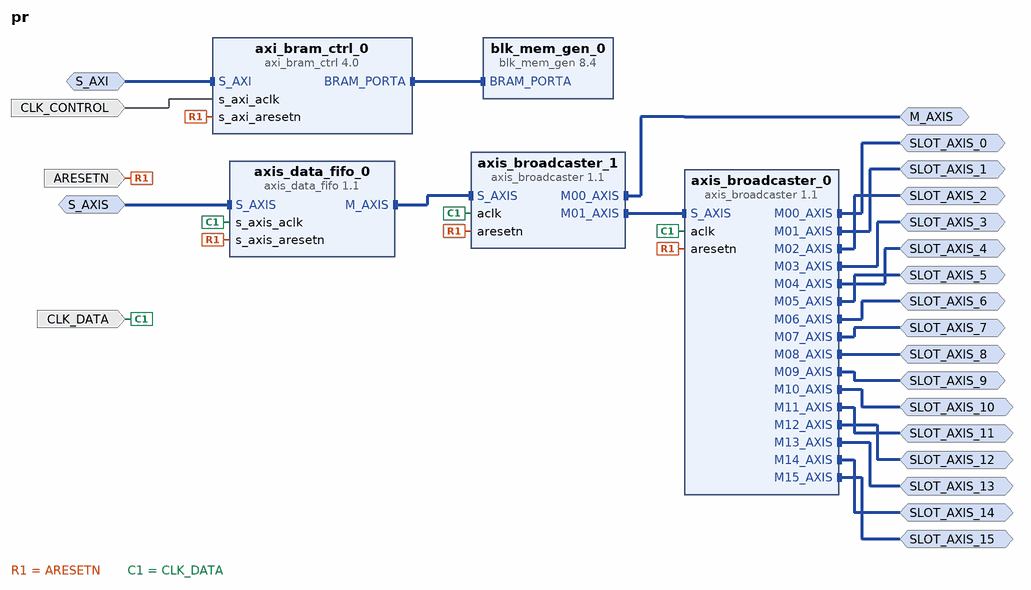
[diagram p0: block diagram of the top level]
# Vivado block design pr, xcku115-flva1517-2-e, Vivado 2017.2
create_bd_design pr

create_bd_intf_port -mode Slave -vlnv xilinx.com:interface:aximm_rtl:1.0 S_AXI
set_property -dict [list \
  CONFIG.DATA_WIDTH 64 \
  CONFIG.PROTOCOL AXI4 \
  CONFIG.ID_WIDTH 0 \
  CONFIG.ADDR_WIDTH 16 \
  CONFIG.AWUSER_WIDTH 0 \
  CONFIG.ARUSER_WIDTH 0 \
  CONFIG.WUSER_WIDTH 0 \
  CONFIG.RUSER_WIDTH 0 \
  CONFIG.BUSER_WIDTH 0 \
  CONFIG.READ_WRITE_MODE READ_WRITE \
  CONFIG.HAS_BURST 1 \
  CONFIG.HAS_LOCK 1 \
  CONFIG.HAS_PROT 1 \
  CONFIG.HAS_CACHE 1 \
  CONFIG.HAS_QOS 0 \
  CONFIG.HAS_REGION 0 \
  CONFIG.HAS_WSTRB 1 \
  CONFIG.HAS_BRESP 1 \
  CONFIG.HAS_RRESP 1 \
  CONFIG.SUPPORTS_NARROW_BURST 1 \
  CONFIG.NUM_READ_OUTSTANDING 2 \
  CONFIG.NUM_WRITE_OUTSTANDING 2 \
  CONFIG.MAX_BURST_LENGTH 256 \
  CONFIG.NUM_READ_THREADS 1 \
  CONFIG.NUM_WRITE_THREADS 1 \
  CONFIG.RUSER_BITS_PER_BYTE 0 \
  CONFIG.WUSER_BITS_PER_BYTE 0 \
] [get_bd_intf_ports S_AXI]
create_bd_intf_port -mode Slave -vlnv xilinx.com:interface:axis_rtl:1.0 S_AXIS
set_property -dict [list \
  CONFIG.TDATA_NUM_BYTES 8 \
  CONFIG.TDEST_WIDTH 0 \
  CONFIG.TID_WIDTH 0 \
  CONFIG.TUSER_WIDTH 0 \
  CONFIG.HAS_TREADY 1 \
  CONFIG.HAS_TSTRB 0 \
  CONFIG.HAS_TKEEP 1 \
  CONFIG.HAS_TLAST 1 \
  CONFIG.LAYERED_METADATA undef \
] [get_bd_intf_ports S_AXIS]
create_bd_intf_port -mode Master -vlnv xilinx.com:interface:axis_rtl:1.0 M_AXIS
set_property -dict {CONFIG.FREQ_HZ 156250000} [get_bd_intf_ports M_AXIS]
create_bd_intf_port -mode Master -vlnv xilinx.com:interface:axis_rtl:1.0 SLOT_AXIS_0
set_property -dict {CONFIG.FREQ_HZ 156250000} [get_bd_intf_ports SLOT_AXIS_0]
create_bd_intf_port -mode Master -vlnv xilinx.com:interface:axis_rtl:1.0 SLOT_AXIS_1
set_property -dict {CONFIG.FREQ_HZ 156250000} [get_bd_intf_ports SLOT_AXIS_1]
create_bd_intf_port -mode Master -vlnv xilinx.com:interface:axis_rtl:1.0 SLOT_AXIS_2
set_property -dict {CONFIG.FREQ_HZ 156250000} [get_bd_intf_ports SLOT_AXIS_2]
create_bd_intf_port -mode Master -vlnv xilinx.com:interface:axis_rtl:1.0 SLOT_AXIS_3
set_property -dict {CONFIG.FREQ_HZ 156250000} [get_bd_intf_ports SLOT_AXIS_3]
create_bd_intf_port -mode Master -vlnv xilinx.com:interface:axis_rtl:1.0 SLOT_AXIS_4
set_property -dict {CONFIG.FREQ_HZ 156250000} [get_bd_intf_ports SLOT_AXIS_4]
create_bd_intf_port -mode Master -vlnv xilinx.com:interface:axis_rtl:1.0 SLOT_AXIS_5
set_property -dict {CONFIG.FREQ_HZ 156250000} [get_bd_intf_ports SLOT_AXIS_5]
create_bd_intf_port -mode Master -vlnv xilinx.com:interface:axis_rtl:1.0 SLOT_AXIS_6
set_property -dict {CONFIG.FREQ_HZ 156250000} [get_bd_intf_ports SLOT_AXIS_6]
create_bd_intf_port -mode Master -vlnv xilinx.com:interface:axis_rtl:1.0 SLOT_AXIS_7
set_property -dict {CONFIG.FREQ_HZ 156250000} [get_bd_intf_ports SLOT_AXIS_7]
create_bd_intf_port -mode Master -vlnv xilinx.com:interface:axis_rtl:1.0 SLOT_AXIS_8
set_property -dict {CONFIG.FREQ_HZ 156250000} [get_bd_intf_ports SLOT_AXIS_8]
create_bd_intf_port -mode Master -vlnv xilinx.com:interface:axis_rtl:1.0 SLOT_AXIS_9
set_property -dict {CONFIG.FREQ_HZ 156250000} [get_bd_intf_ports SLOT_AXIS_9]
create_bd_intf_port -mode Master -vlnv xilinx.com:interface:axis_rtl:1.0 SLOT_AXIS_10
set_property -dict {CONFIG.FREQ_HZ 156250000} [get_bd_intf_ports SLOT_AXIS_10]
create_bd_intf_port -mode Master -vlnv xilinx.com:interface:axis_rtl:1.0 SLOT_AXIS_11
set_property -dict {CONFIG.FREQ_HZ 156250000} [get_bd_intf_ports SLOT_AXIS_11]
create_bd_intf_port -mode Master -vlnv xilinx.com:interface:axis_rtl:1.0 SLOT_AXIS_12
set_property -dict {CONFIG.FREQ_HZ 156250000} [get_bd_intf_ports SLOT_AXIS_12]
create_bd_intf_port -mode Master -vlnv xilinx.com:interface:axis_rtl:1.0 SLOT_AXIS_13
set_property -dict {CONFIG.FREQ_HZ 156250000} [get_bd_intf_ports SLOT_AXIS_13]
create_bd_intf_port -mode Master -vlnv xilinx.com:interface:axis_rtl:1.0 SLOT_AXIS_14
set_property -dict {CONFIG.FREQ_HZ 156250000} [get_bd_intf_ports SLOT_AXIS_14]
create_bd_intf_port -mode Master -vlnv xilinx.com:interface:axis_rtl:1.0 SLOT_AXIS_15
set_property -dict {CONFIG.FREQ_HZ 156250000} [get_bd_intf_ports SLOT_AXIS_15]
create_bd_port -dir I -type clk CLK_CONTROL
create_bd_port -dir I -type rst ARESETN
create_bd_port -dir I -type clk CLK_DATA
set_property -dict {CONFIG.FREQ_HZ 156250000} [get_bd_ports CLK_DATA]

create_bd_cell -type ip -vlnv xilinx.com:ip:blk_mem_gen:8.4 blk_mem_gen_0
create_bd_cell -type ip -vlnv xilinx.com:ip:axi_bram_ctrl:4.0 axi_bram_ctrl_0
set_property -dict {CONFIG.DATA_WIDTH 64 CONFIG.SINGLE_PORT_BRAM 1} [get_bd_cells axi_bram_ctrl_0]
create_bd_cell -type ip -vlnv xilinx.com:ip:axis_broadcaster:1.1 axis_broadcaster_0
set_property -dict [list \
  CONFIG.NUM_MI 16 \
  CONFIG.M_TDATA_NUM_BYTES 8 \
  CONFIG.S_TDATA_NUM_BYTES 8 \
  CONFIG.TDEST_WIDTH 16 \
  CONFIG.HAS_TSTRB 0 \
  CONFIG.HAS_TKEEP 1 \
  CONFIG.HAS_TLAST 1 \
  CONFIG.M02_TDATA_REMAP {tdata[63:0]} \
  CONFIG.M03_TDATA_REMAP {tdata[63:0]} \
  CONFIG.M04_TDATA_REMAP {tdata[63:0]} \
  CONFIG.M05_TDATA_REMAP {tdata[63:0]} \
  CONFIG.M06_TDATA_REMAP {tdata[63:0]} \
  CONFIG.M07_TDATA_REMAP {tdata[63:0]} \
  CONFIG.M08_TDATA_REMAP {tdata[63:0]} \
  CONFIG.M09_TDATA_REMAP {tdata[63:0]} \
  CONFIG.M10_TDATA_REMAP {tdata[63:0]} \
  CONFIG.M11_TDATA_REMAP {tdata[63:0]} \
  CONFIG.M12_TDATA_REMAP {tdata[63:0]} \
  CONFIG.M13_TDATA_REMAP {tdata[63:0]} \
  CONFIG.M14_TDATA_REMAP {tdata[63:0]} \
  CONFIG.M15_TDATA_REMAP {tdata[63:0]} \
] [get_bd_cells axis_broadcaster_0]
create_bd_cell -type ip -vlnv xilinx.com:ip:axis_data_fifo:1.1 axis_data_fifo_0
set_property -dict [list \
  CONFIG.TDATA_NUM_BYTES 8 \
  CONFIG.TDEST_WIDTH 16 \
  CONFIG.HAS_TKEEP 1 \
  CONFIG.HAS_TLAST 1 \
] [get_bd_cells axis_data_fifo_0]
create_bd_cell -type ip -vlnv xilinx.com:ip:axis_broadcaster:1.1 axis_broadcaster_1

# ---- connections ----

connect_bd_intf_net [get_bd_intf_pins axi_bram_ctrl_0/BRAM_PORTA] [get_bd_intf_pins blk_mem_gen_0/BRAM_PORTA]
connect_bd_intf_net [get_bd_intf_pins axis_data_fifo_0/M_AXIS] [get_bd_intf_pins axis_broadcaster_1/S_AXIS]
connect_bd_intf_net [get_bd_intf_pins axis_broadcaster_1/M01_AXIS] [get_bd_intf_pins axis_broadcaster_0/S_AXIS]
connect_bd_intf_net [get_bd_intf_ports S_AXI] [get_bd_intf_pins axi_bram_ctrl_0/S_AXI]
connect_bd_intf_net [get_bd_intf_ports S_AXIS] [get_bd_intf_pins axis_data_fifo_0/S_AXIS]
connect_bd_intf_net [get_bd_intf_ports M_AXIS] [get_bd_intf_pins axis_broadcaster_1/M00_AXIS]
connect_bd_intf_net [get_bd_intf_ports SLOT_AXIS_0] [get_bd_intf_pins axis_broadcaster_0/M00_AXIS]
connect_bd_intf_net [get_bd_intf_ports SLOT_AXIS_1] [get_bd_intf_pins axis_broadcaster_0/M01_AXIS]
connect_bd_intf_net [get_bd_intf_ports SLOT_AXIS_2] [get_bd_intf_pins axis_broadcaster_0/M02_AXIS]
connect_bd_intf_net [get_bd_intf_ports SLOT_AXIS_3] [get_bd_intf_pins axis_broadcaster_0/M03_AXIS]
connect_bd_intf_net [get_bd_intf_ports SLOT_AXIS_4] [get_bd_intf_pins axis_broadcaster_0/M04_AXIS]
connect_bd_intf_net [get_bd_intf_ports SLOT_AXIS_5] [get_bd_intf_pins axis_broadcaster_0/M05_AXIS]
connect_bd_intf_net [get_bd_intf_ports SLOT_AXIS_6] [get_bd_intf_pins axis_broadcaster_0/M06_AXIS]
connect_bd_intf_net [get_bd_intf_ports SLOT_AXIS_7] [get_bd_intf_pins axis_broadcaster_0/M07_AXIS]
connect_bd_intf_net [get_bd_intf_ports SLOT_AXIS_8] [get_bd_intf_pins axis_broadcaster_0/M08_AXIS]
connect_bd_intf_net [get_bd_intf_ports SLOT_AXIS_9] [get_bd_intf_pins axis_broadcaster_0/M09_AXIS]
connect_bd_intf_net [get_bd_intf_ports SLOT_AXIS_10] [get_bd_intf_pins axis_broadcaster_0/M10_AXIS]
connect_bd_intf_net [get_bd_intf_ports SLOT_AXIS_11] [get_bd_intf_pins axis_broadcaster_0/M11_AXIS]
connect_bd_intf_net [get_bd_intf_ports SLOT_AXIS_12] [get_bd_intf_pins axis_broadcaster_0/M12_AXIS]
connect_bd_intf_net [get_bd_intf_ports SLOT_AXIS_13] [get_bd_intf_pins axis_broadcaster_0/M13_AXIS]
connect_bd_intf_net [get_bd_intf_ports SLOT_AXIS_14] [get_bd_intf_pins axis_broadcaster_0/M14_AXIS]
connect_bd_intf_net [get_bd_intf_ports SLOT_AXIS_15] [get_bd_intf_pins axis_broadcaster_0/M15_AXIS]
connect_bd_net -net s_axi_aclk_1 [get_bd_ports CLK_CONTROL] [get_bd_pins axi_bram_ctrl_0/s_axi_aclk]
connect_bd_net -net s_axi_aresetn_1 [get_bd_ports ARESETN] \
  [get_bd_pins axi_bram_ctrl_0/s_axi_aresetn] [get_bd_pins axis_data_fifo_0/s_axis_aresetn] \
  [get_bd_pins axis_broadcaster_1/aresetn] [get_bd_pins axis_broadcaster_0/aresetn]
connect_bd_net -net s_axis_aclk_1 [get_bd_ports CLK_DATA] \
  [get_bd_pins axis_data_fifo_0/s_axis_aclk] [get_bd_pins axis_broadcaster_1/aclk] [get_bd_pins axis_broadcaster_0/aclk]

validate_bd_design
save_bd_design
